# EAGLE design KimCard-r5 (EAGLE 7.2.0)
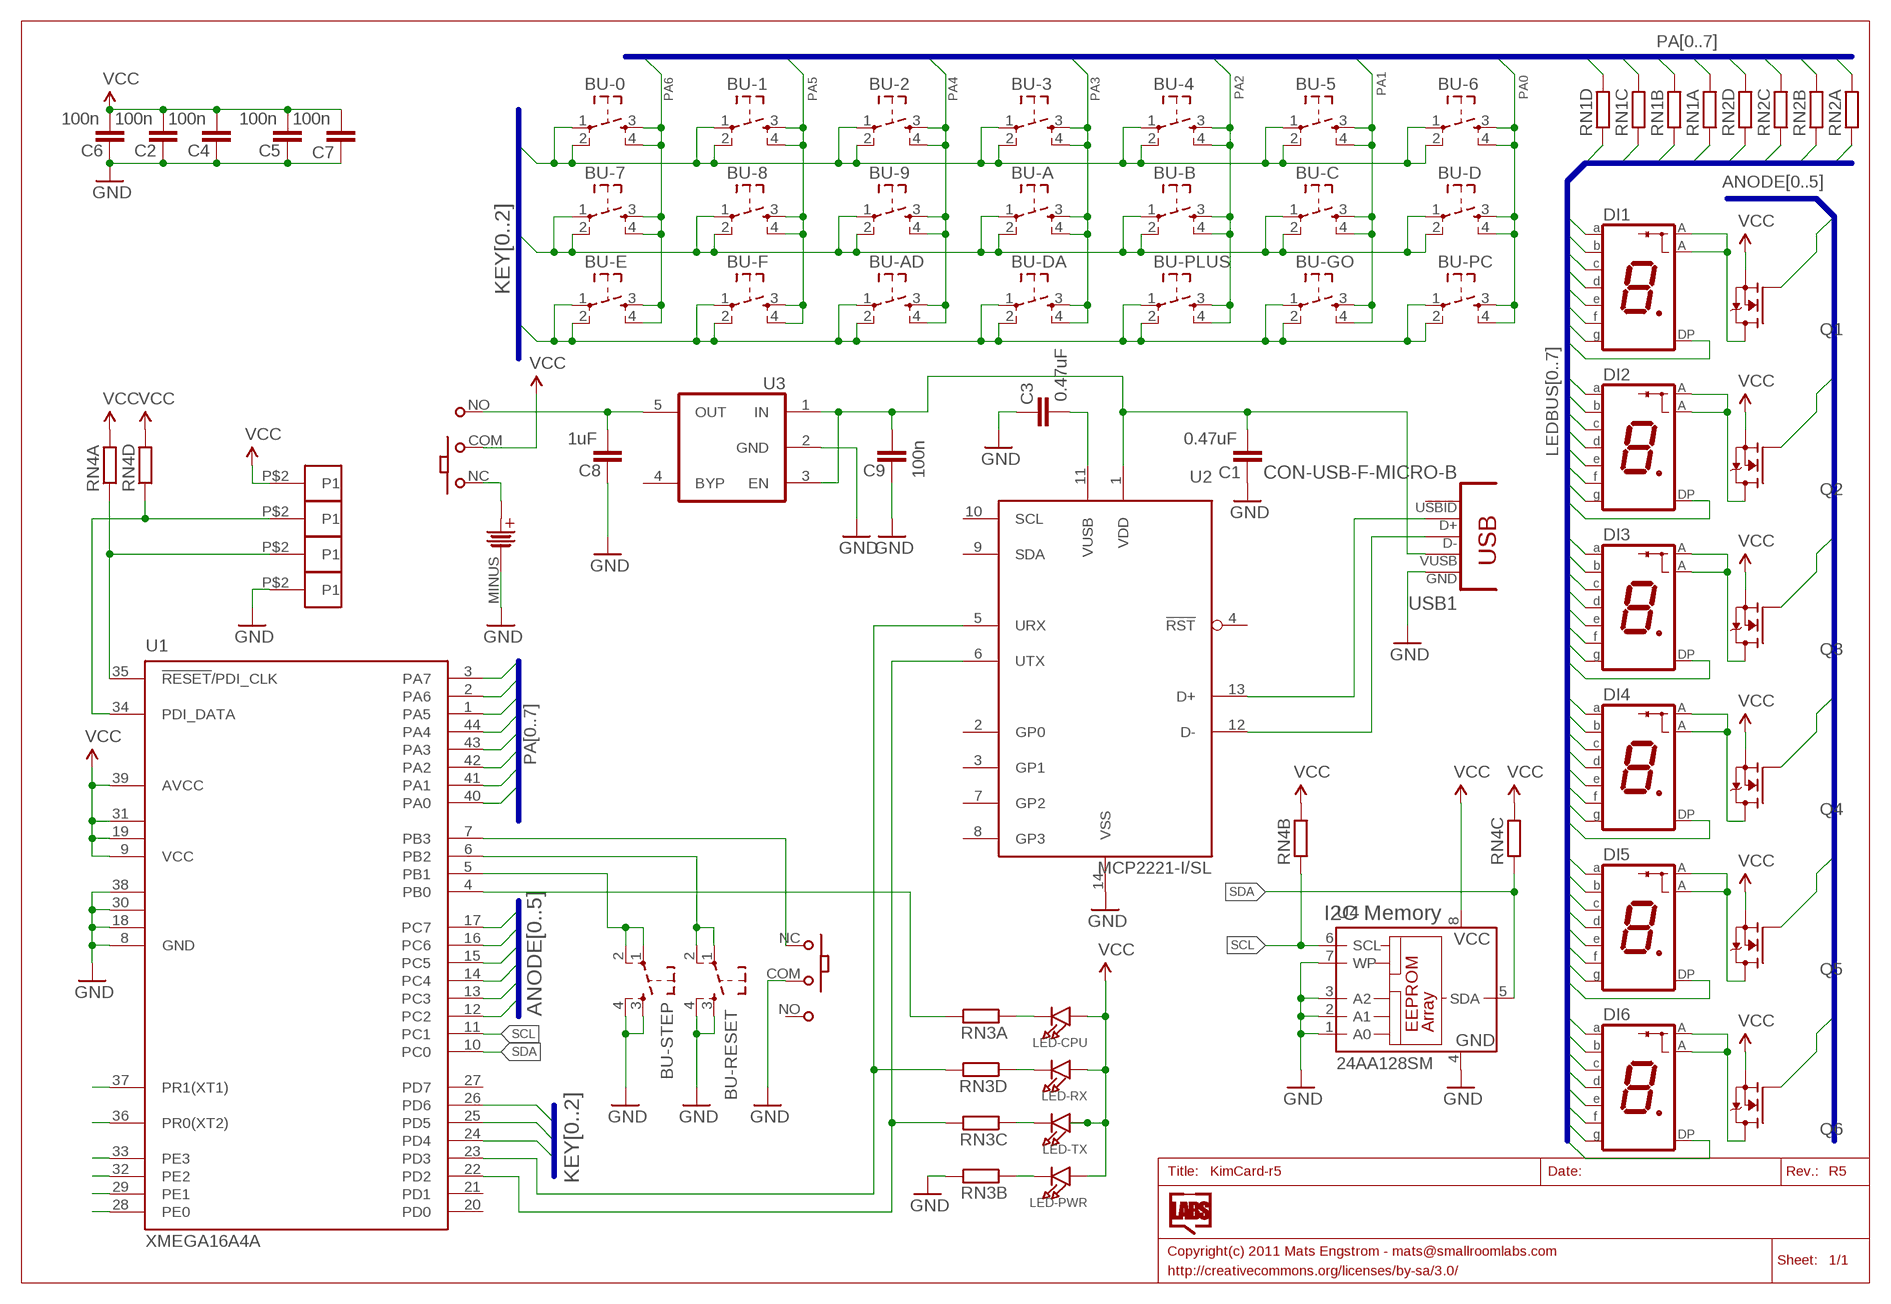
[diagram p0: schematic, sheet 1]

## Parts
BA1  BATTERY-3V  [AAAX2]
BU-0  SW_TACT_4P  [SW_TACT_SMALL]
BU-1  SW_TACT_4P  [SW_TACT_SMALL]
BU-2  SW_TACT_4P  [SW_TACT_SMALL]
BU-3  SW_TACT_4P  [SW_TACT_SMALL]
BU-4  SW_TACT_4P  [SW_TACT_SMALL]
BU-5  SW_TACT_4P  [SW_TACT_SMALL]
BU-6  SW_TACT_4P  [SW_TACT_SMALL]
BU-7  SW_TACT_4P  [SW_TACT_SMALL]
BU-8  SW_TACT_4P  [SW_TACT_SMALL]
BU-9  SW_TACT_4P  [SW_TACT_SMALL]
BU-A  SW_TACT_4P  [SW_TACT_SMALL]
BU-AD  SW_TACT_4P  [SW_TACT_SMALL]
BU-B  SW_TACT_4P  [SW_TACT_SMALL]
BU-C  SW_TACT_4P  [SW_TACT_SMALL]
BU-D  SW_TACT_4P  [SW_TACT_SMALL]
BU-DA  SW_TACT_4P  [SW_TACT_SMALL]
BU-E  SW_TACT_4P  [SW_TACT_SMALL]
BU-F  SW_TACT_4P  [SW_TACT_SMALL]
BU-GO  SW_TACT_4P  [SW_TACT_SMALL]
BU-PC  SW_TACT_4P  [SW_TACT_SMALL]
BU-PLUS  SW_TACT_4P  [SW_TACT_SMALL]
BU-RESET  SW_TACT_4P  [SW_TACT_SMALL]
BU-STEP  SW_TACT_4P  [SW_TACT_SMALL]
C1  0.47uF  CAP0805  [0805]
C2  100n  CAP0805  [0805]
C3  0.47uF  CAP0805  [0805]
C4  100n  CAP0805  [0805]
C5  100n  CAP0805  [0805]
C6  100n  CAP0805  [0805]
C7  100n  CAP0805  [0805]
C8  1uF  CAP0805  [0805]
C9  100n  CAP0805  [0805]
DI1  7SEG-CA2  [KCSA03]
DI2  7SEG-CA2  [KCSA03]
DI3  7SEG-CA2  [KCSA03]
DI4  7SEG-CA2  [KCSA03]
DI5  7SEG-CA2  [KCSA03]
DI6  7SEG-CA2  [KCSA03]
LED-CPU  LEDSMD0805  [CHIPLED_0805]
LED-PWR  LEDSMD0805  [CHIPLED_0805]
LED-RX  LEDSMD0805  [CHIPLED_0805]
LED-TX  LEDSMD0805  [CHIPLED_0805]
PDI-CLK  PAD-2X3  [PAD2X3]
PDI-DATA  PAD-2X3  [PAD2X3]
PDI-GND  PAD-2X3  [PAD2X3]
PDI-VCC  PAD-2X3  [PAD2X3]
Q1  TRANSISTOR_FET_BS170-SOT-23  [SOT-23]
Q2  TRANSISTOR_FET_BS170-SOT-23  [SOT-23]
Q3  TRANSISTOR_FET_BS170-SOT-23  [SOT-23]
Q4  TRANSISTOR_FET_BS170-SOT-23  [SOT-23]
Q5  TRANSISTOR_FET_BS170-SOT-23  [SOT-23]
Q6  TRANSISTOR_FET_BS170-SOT-23  [SOT-23]
RN1  RESISTOR_ARRAY_4  [RN8P-4R-CRA06S]
RN2  RESISTOR_ARRAY_4  [RN8P-4R-CRA06S]
RN3  RESISTOR_ARRAY_4  [RN8P-4R-CRA06S]
RN4  RESISTOR_ARRAY_4  [RN8P-4R-CRA06S]
U1  XMEGA16A4A  [TQFP44]
U2  MCP2221-I/SL  [SOIC14]
U3  VREG_5PINS-SOT-23-5  [SOT-23-5]
U4  24AA128SM  [SO-08M]
U$1  SLIDESWITCHPCM12SMTR  [PCM12SMTR]
U$2  SLIDESWITCHPCM12SMTR  [PCM12SMTR]
USB1  CON-USB-F-MICRO-B  [CONN_USB_MICRO-B]

## Nets
BAT: BA1.PLUS U$1.NC
CPU: RN3.8 U1.4(PB0)
GND [pwr2]: BA1.MINUS BU-RESET.3 BU-RESET.4 BU-STEP.3 BU-STEP.4 C1.1 C2.1 C3.1 C4.1 C5.1 C6.1 C7.1 C8.1 C9.1 PDI-GND.P$2(P1) RN3.7 U1.8(GND) U1.18(GND1) U1.30(GND2) U1.38(GND3) U2.14(VSS) U3.2(GND) U4.1(A0) U4.2(A1) U4.3(A2) U4.4(GND) U4.7(WP) U$2.COM USB1.P5(GND)
KEYROW0: BU-0.1 BU-0.2 BU-1.1 BU-1.2 BU-2.1 BU-2.2 BU-3.1 BU-3.2 BU-4.1 BU-4.2 BU-5.1 BU-5.2 BU-6.1 BU-6.2 U1.24(PD4)
KEYROW1: BU-7.1 BU-7.2 BU-8.1 BU-8.2 BU-9.1 BU-9.2 BU-A.1 BU-A.2 BU-B.1 BU-B.2 BU-C.1 BU-C.2 BU-D.1 BU-D.2 U1.25(PD5)
KEYROW2: BU-AD.1 BU-AD.2 BU-DA.1 BU-DA.2 BU-E.1 BU-E.2 BU-F.1 BU-F.2 BU-GO.1 BU-GO.2 BU-PC.1 BU-PC.2 BU-PLUS.1 BU-PLUS.2 U1.26(PD6)
LEDBUS0: DI1.P$7(A) DI2.P$7(A) DI3.P$7(A) DI4.P$7(A) DI5.P$7(A) DI6.P$7(A) RN2.1
LEDBUS1: DI1.P$6(B) DI2.P$6(B) DI3.P$6(B) DI4.P$6(B) DI5.P$6(B) DI6.P$6(B) RN2.2
LEDBUS2: DI1.P$4(C) DI2.P$4(C) DI3.P$4(C) DI4.P$4(C) DI5.P$4(C) DI6.P$4(C) RN2.3
LEDBUS3: DI1.P$2(D) DI2.P$2(D) DI3.P$2(D) DI4.P$2(D) DI5.P$2(D) DI6.P$2(D) RN2.4
LEDBUS4: DI1.P$1(E) DI2.P$1(E) DI3.P$1(E) DI4.P$1(E) DI5.P$1(E) DI6.P$1(E) RN1.1
LEDBUS5: DI1.P$9(F) DI2.P$9(F) DI3.P$9(F) DI4.P$9(F) DI5.P$9(F) DI6.P$9(F) RN1.2
LEDBUS6: DI1.P$10(G) DI2.P$10(G) DI3.P$10(G) DI4.P$10(G) DI5.P$10(G) DI6.P$10(G) RN1.3
LEDBUS7: DI1.P$5(DP) DI2.P$5(DP) DI3.P$5(DP) DI4.P$5(DP) DI5.P$5(DP) DI6.P$5(DP) RN1.4
LEDCA0: Q1.1(G) U1.12(PC2)
LEDCA1: Q2.1(G) U1.13(PC3)
LEDCA2: Q3.1(G) U1.14(PC4)
LEDCA3: Q4.1(G) U1.15(PC5)
LEDCA4: Q5.1(G) U1.16(PC6)
LEDCA5: Q6.1(G) U1.17(PC7)
N$1: RN3.5 U1.23(PD3) U2.5(URX)
N$2: LED-RX.C RN3.4
N$3: U2.13(D+) USB1.P3(D+)
N$4: U2.12(D-) USB1.P2(D-)
N$5: C3.2 U2.11(VUSB)
N$6: RN3.6 U1.22(PD2) U2.6(UTX)
N$7: LED-TX.C RN3.3
N$9: C8.2 U3.5(OUT) U$1.NO
N$11: LED-PWR.C RN3.2
N$12: LED-CPU.C RN3.1
PA0: BU-6.3 BU-6.4 BU-D.3 BU-D.4 BU-PC.3 BU-PC.4 RN2.8 U1.40(PA0)
PA1: BU-5.3 BU-5.4 BU-C.3 BU-C.4 BU-GO.3 BU-GO.4 RN2.7 U1.41(PA1)
PA2: BU-4.3 BU-4.4 BU-B.3 BU-B.4 BU-PLUS.3 BU-PLUS.4 RN2.6 U1.42(PA2)
PA3: BU-3.3 BU-3.4 BU-A.3 BU-A.4 BU-DA.3 BU-DA.4 RN2.5 U1.43(PA3)
PA4: BU-2.3 BU-2.4 BU-9.3 BU-9.4 BU-AD.3 BU-AD.4 RN1.8 U1.44(PA4)
PA5: BU-1.3 BU-1.4 BU-8.3 BU-8.4 BU-F.3 BU-F.4 RN1.7 U1.1(PA5)
PA6: BU-0.3 BU-0.4 BU-7.3 BU-7.4 BU-E.3 BU-E.4 RN1.6 U1.2(PA6)
PA7: RN1.5 U1.3(PA7)
PDI_CLOCK: PDI-CLK.P$2(P1) RN4.1 U1.35(!RESET!/PDI_CLK)
PDI_DATA: PDI-DATA.P$2(P1) RN4.4 U1.34(PDI_DATA)
PE0: U1.28(PE0)
PE1: U1.29(PE1)
PE2: U1.32(PE2)
PE3: U1.33(PE3)
PR1: U1.37(PR1(XT1))
PR2: U1.36(PR0(XT2))
Q1C: DI1.P$3(A) DI1.P$8(A) Q1.3(D)
Q2C: DI2.P$3(A) DI2.P$8(A) Q2.3(D)
Q3C: DI3.P$3(A) DI3.P$8(A) Q3.3(D)
Q4C: DI4.P$3(A) DI4.P$8(A) Q4.3(D)
Q5C: DI5.P$3(A) DI5.P$8(A) Q5.3(D)
Q6C: DI6.P$3(A) DI6.P$8(A) Q6.3(D)
RSET: BU-RESET.1 BU-RESET.2 U1.6(PB2)
SCL: RN4.2 U1.11(PC1) U4.6(SCL)
SDA: RN4.3 U1.10(PC0) U4.5(SDA)
SST: U1.7(PB3) U$2.NC
STEP: BU-STEP.1 BU-STEP.2 U1.5(PB1)
VCC [pwr1]: C2.2 C4.2 C5.2 C6.2 C7.2 LED-CPU.A LED-PWR.A LED-RX.A LED-TX.A PDI-VCC.P$2(P1) Q1.2(S) Q2.2(S) Q3.2(S) Q4.2(S) Q5.2(S) Q6.2(S) RN4.5 RN4.6 RN4.7 RN4.8 U1.9(VCC) U1.19(VCC1) U1.31(VCC2) U1.39(AVCC) U4.8(VCC) U$1.COM
VUSB: C1.2 C9.2 U2.1(VDD) U3.1(IN) U3.3(EN) USB1.P1(VUSB)
Unconnected: U1.20(PD0) U1.21(PD1) U1.27(PD7) U2.2(GP0) U2.3(GP1) U2.4(!RST) U2.7(GP2) U2.8(GP3) U2.9(SDA) U2.10(SCL) U3.4(BYP) U$2.NO USB1.BODY@1(BODY) USB1.BODY@2(BODY) USB1.BODY@3(BODY) USB1.BODY@4(BODY) USB1.P4(USBID)

## Buses
LEDBUS[0..7]
PA[0..7]
ANODE[0..5]
KEY[0..2]

## Notes on the sheet
- I2C Memory

## Library data of the parts
BA1 = SmallRoomLabs_Battery:BATTERY-3V
BU-0 BU-1-BU-9 BU-A BU-AD BU-B BU-C BU-D BU-DA BU-E BU-F BU-GO BU-PC BU-PLUS BU-RESET BU-STEP = dp_devices:SW_TACT_4P
C1-C9 = SparkFun:CAP: Capacitor Standard 0603 ceramic capacitor, and 0.1" leaded capacitor.
DI1-DI6 = SmallRoomLabs_Led:7SEG-CA2
LED-CPU LED-PWR LED-RX LED-TX = SmallRoomLabs:LED
PDI-CLK PDI-DATA PDI-GND PDI-VCC = SmallRoomLabs:PAD
Q1-Q6 = dp_devices:TRANSISTOR_FET_BS170: N-Channel Enhancement Mode Field Effect Transistor
RN1-RN4 = dp_devices:RESISTOR_ARRAY_4: 4 Resistor Array 0603
U1 = atmel:XMEGA16A4: MICROCONTROLLER Features High-performance, Low-power 8/16-bit AVR XMEGA Microcontroller Non-Volatile Program and Data Memories - 16 KB - 128 KB of In-System Self-Programmable Flash - 4 KB - 8 KB Boot Code Section with Independent Lock Bits - 1 KB - 2 KB EEPROM - 2 KB - 8 KB Internal SRAM Peripheral Features - Four-channel DMA Controller with support for external requests - Eight-channel Event System - Five 16-bit Timer/Counters Three Timer/Counters with 4 Output Compare or Input Capture channels Two Timer/Counters with 2 Output Compare or Input Capture channels High-Resolution Extensions on all Timer/Counters Advanced Waveform Extension on one Timer/Counter - Five USARTs IrDA Extension on one USART - Two Two-Wire Interfaces with dual address match (I2C and SMBus compatible) - Two SPIs (Serial Peripheral Interfaces) peripherals - AES and DES Crypto Engine - 16-bit Real Time Counter with Separate Oscillator - One Twelve-channel, 12-bit, 2 Msps Analog to Digital Converter - One Two-channel, 12-bit, 1 Msps Digital to Analog Converter - Two Analog Comparators with Window compare function - External Interrupts on all General Purpose I/O pins - Programmable Watchdog Timer with Separate On-chip Ultra Low Power Oscillator Special Microcontroller Features - Power-on Reset and Programmable Brown-out Detection - Internal and External Clock Options with PLL - Programmable Multi-level Interrupt Controller - Sleep Modes: Idle, Power-down, Standby, Power-save, Extended Standby - Advanced Programming, Test and Debugging Interfaces PDI (Program and Debug Interface) for programming, test and debugging I/O and Packages - 34 Programmable I/O Lines - 44 - lead TQFP - 44 - pad VQFN/QFN - 49 - ball VFBGA Operating Voltage - 1.6 - 3.6V Speed performance - 0 - 12 MHz @ 1.6 - 3.6V - 0 - 32 MHz @ 2.7 - 3.6V Drawn by Dipl.-Ing. (FH) Robert Siegler Created: 27.05.09; OC_FARNELL: unknown; OC_NEWARK: unknown
U2 = microchip-mcp2221:MCP2221-*: MCP2221 in PDIP, SOIC and TSSOP package The MCP2221 is a USB-to-UART/I2C serial converter which enables USB connectivity in applications that have a UART and I2C interfaces. The device reduces external components by integrating the USB termination resistors and the oscillator needed for USB operation. The MCP2221 also has four GP pins providing miscellaneous functionalities (GPIO, USBCFG, SSPND, Clock Output, ADC, DAC, interrupt detector). Source: www.microchip.com/MCP2221 <http://www.microchip.com/wwwproducts/Devices.aspx?product=MCP2221> and www.microchipdirect.com <http://www.microchipdirect.com/ProductDetails.aspx?Category=MCP2221> Tutorial: MCP2221 by Arnauld Biganzoli <https://docs.google.com/document/d/1P3zzqCKdEXzCe--1Yyg8PClCZKsUri8pyNO7AV2daaw/edit?usp=sharing>
U3 = dp_devices:VREG_5PINS: 5 pins voltage regulator
U4 = microchip:24*: Serial EEPROM I2C; MF: MICROCHIP; MPN: 24AA128-I/MS; OC_FARNELL: 1331285; OC_NEWARK: 92C6839
U$1 U$2 = Nerdlabs:SLIDESWITCH
USB1 = dp_devices:CON-USB-F: USB Female connector

## Net classes
0 default: width 0.203 mm, drill 0.305 mm, clearance 0.203 mm
1 pwr1: width 0.203 mm, drill 0.305 mm, clearance 0.203 mm
2 gnd1: width 0.203 mm, drill 0.305 mm, clearance 0.203 mm
3 pwr2: width 0.203 mm, drill 0.305 mm, clearance 0.203 mm

## Board
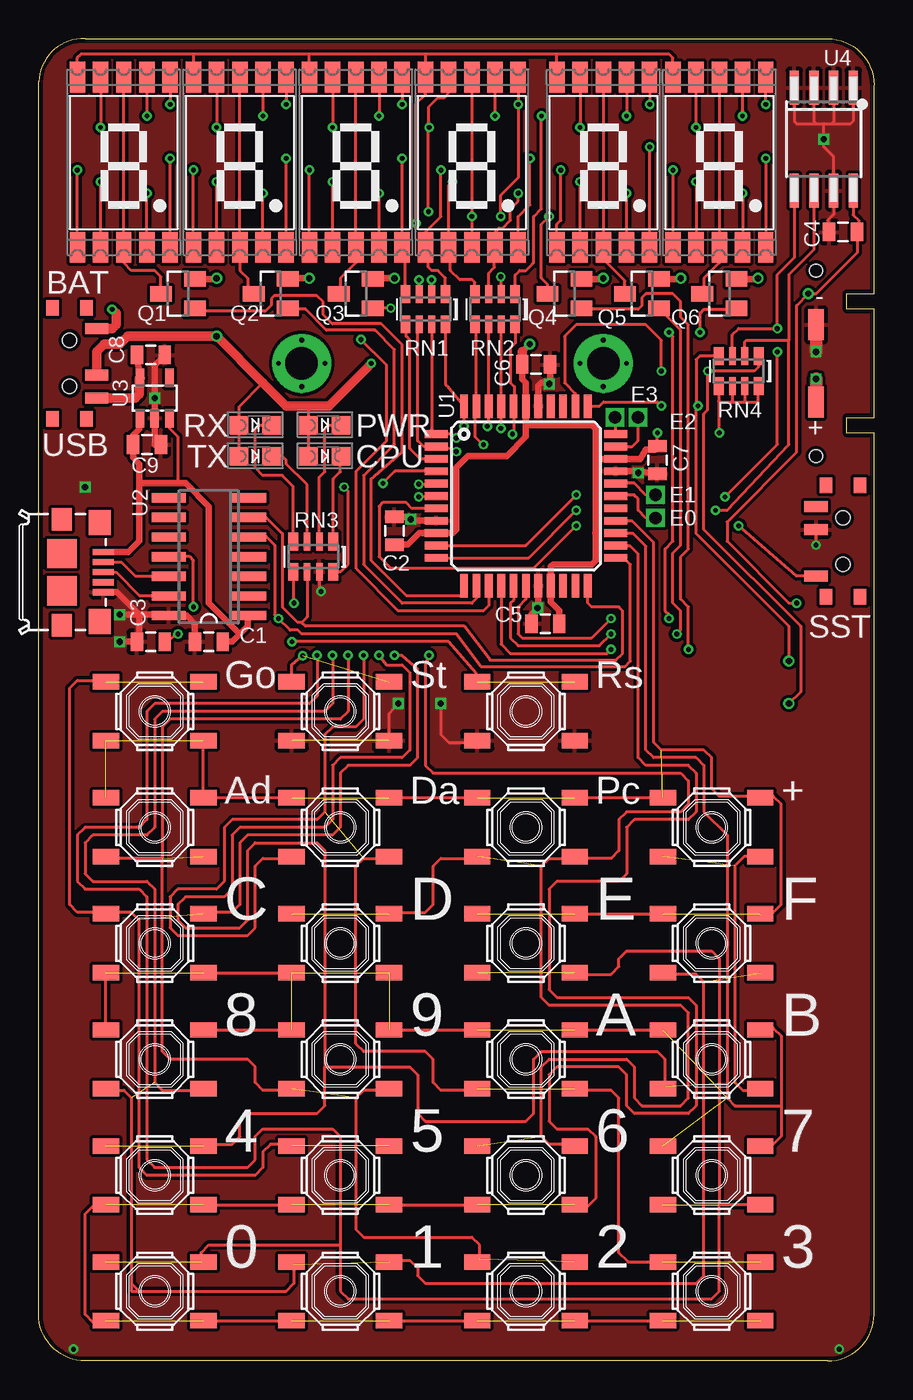
[diagram p1: board, top side]
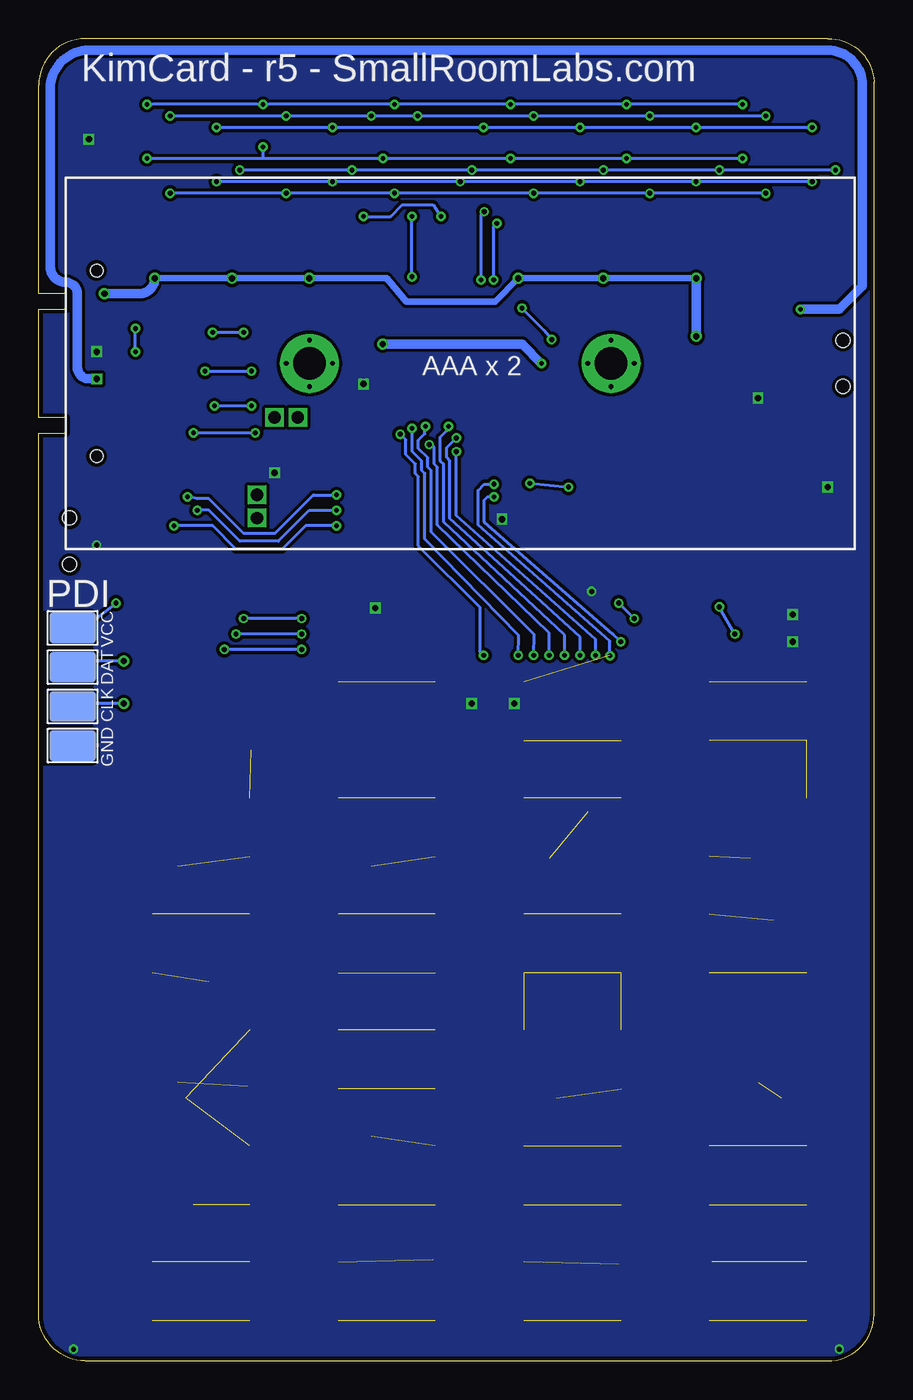
[diagram p2: board, bottom side, seen from below]

Size 54 x 85.5 mm. Coordinates in mm from the lower left corner, seen from the top.
Outline: 54,3 arc-90 51,0 3,0 arc-90 0,3 0,82.7 arc-90 3,85.5 51,85.5 arc-90 54,82.5
Outline: 54,82.5 arc0 54,82.5
Outline: 54,3 54,60 52.25,60 52.25,61 54,61 54,68 52.25,68 52.25,69 54,69 54,82.5
Copper layers (1*16): Top 0.035mm / dielectric 1.5mm / Bottom 0.035mm
Design rules "dirt_cheap_dirty_boards.v1": minimum track width 5mil, minimum drill 12mil, track to track 5mil, track to pad 5mil, pad to pad 5mil, via to via 5mil, smd to smd 0mil, copper to edge 10mil, drill to drill 10mil, minimum pad ring 10mil, minimum via ring 6mil, stop-mask expansion 2mil, vias tented up to drill 25mil, thermal gap 10mil
tKeepout: area 22.1,17.8 to 24.1,20.1
tRestrict: area 23.5,66.3 to 31.2,69.5
bRestrict: area 50.5,38.5 to 54,48.5

### Footprints (pad centres in the part's own frame; a part is rotated, then mirrored left to right if it is on the bottom)
AAAX2 = drill 2.1 pad 3.8: 1 -9.75,0; 2 9.75,0 | drill 0.305: 3 -11.25,0; 4 -8.25,0; 5 -9.75,-1.5; 6 -9.75,1.5; 7 8.25,0; 8 11.25,0; 9 9.75,-1.5; 10 9.75,1.5 | smd 1 x 2 bottom: MINUS 23.5,-2.5; PLUS 23.5,2.5 | hole 0.813: 23.5,6; 23.5,-6
SW_TACT_SMALL = smd 1.7 x 1: 1 -3.15,1.9; 2 3.15,1.9; 3 -3.15,-1.9; 4 3.15,-1.9
0805 = smd 0.8 x 1.2: 1 -0.9,0; 2 0.9,0
KCSA03 = smd 1 x 2: P$1 -3,-5.5; P$2 -1.5,-5.5; P$3 0,-5.5; P$4 1.5,-5.5; P$5 3,-5.5; P$6 3,5.5; P$7 1.5,5.5; P$8 0,5.5; P$9 -1.5,5.5; P$10 -3,5.5
CHIPLED_0805 = smd 1.2 x 1.2: A 0,-1.05; C 0,1.05
PAD2X3 = smd 2 x 3: P$2 0,0
SOT-23 = smd 1 x 1.4: 1 -0.95,-1.1; 2 0.95,-1.1; 3 0,1.1
RN8P-4R-CRA06S = smd 0.63 x 1.15: 1 -1.295,-0.975; 4 1.295,-0.975; 5 1.295,0.975; 8 -1.295,0.975 | smd 0.44 x 1.15: 2 -0.4,-0.975; 3 0.4,-0.975; 6 0.4,0.975; 7 -0.4,0.975
TQFP44 = smd 1.5 x 0.5: 1 -5.8,4; 2 -5.8,3.2; 3 -5.8,2.4; 4 -5.8,1.6; 5 -5.8,0.8; 6 -5.8,0; 7 -5.8,-0.8; 8 -5.8,-1.6; 9 -5.8,-2.4; 10 -5.8,-3.2; 11 -5.8,-4; 23 5.8,-4; 24 5.8,-3.2; 25 5.8,-2.4; 26 5.8,-1.6; 27 5.8,-0.8; 28 5.8,0; 29 5.8,0.8; 30 5.8,1.6; 31 5.8,2.4; 32 5.8,3.2; 33 5.8,4 | smd 0.5 x 1.5: 12 -4,-5.8; 13 -3.2,-5.8; 14 -2.4,-5.8; 15 -1.6,-5.8; 16 -0.8,-5.8; 17 0,-5.8; 18 0.8,-5.8; 19 1.6,-5.8; 20 2.4,-5.8; 21 3.2,-5.8; 22 4,-5.8; 34 4,5.8; 35 3.2,5.8; 36 2.4,5.8; 37 1.6,5.8; 38 0.8,5.8; 39 0,5.8; 40 -0.8,5.8; 41 -1.6,5.8; 42 -2.4,5.8; 43 -3.2,5.8; 44 -4,5.8
SOIC14 = smd 0.6 x 2.2: 1 -3.81,-2.6; 2 -2.54,-2.6; 3 -1.27,-2.6; 4 0,-2.6; 5 1.27,-2.6; 6 2.54,-2.6; 7 3.81,-2.6; 8 3.81,2.6; 9 2.54,2.6; 10 1.27,2.6; 11 0,2.6; 12 -1.27,2.6; 13 -2.54,2.6; 14 -3.81,2.6
SOT-23-5 = smd 0.55 x 1.2: 1 -0.95,-1.3; 2 0,-1.3; 3 0.95,-1.3; 4 0.95,1.3; 5 -0.95,1.3
SO-08M = smd 0.6 x 2.2: 1 -1.905,-3.33; 2 -0.635,-3.33; 3 0.635,-3.33; 4 1.905,-3.33; 5 1.905,3.33; 6 0.635,3.33; 7 -0.635,3.33; 8 -1.905,3.33
PCM12SMTR = smd 0.7 x 1.5: COM 0.75,1.75; NC -2.25,1.75; NO 2.25,1.75 | smd 1 x 0.8: P$1 -3.6,-1.1; P$2 -3.6,1.1; P$3 3.6,1.1; P$4 3.6,-1.1 | hole 0.9: -1.5,0; 1.5,0
CONN_USB_MICRO-B = smd 1.6 x 1.4: BODY@1 -3.2,2.45; BODY@2 3.2,2.45 | smd 1.45 x 1.3: BODY@3 3.425,0; BODY@6 -3.425,0 | smd 1.9 x 1.9: BODY@4 1.2,0; BODY@5 -1.2,0 | smd 0.4 x 1.35: P1 -1.3,2.675; P2 -0.65,2.675; P3 0,2.675; P4 0.65,2.675; P5 1.3,2.675

### Placement (x,y rotation side)
BA1  26.75,64.5 180 bottom
BU-0  7.5,4.5 180 top
BU-1  19.5,4.5 180 top
BU-2  31.5,4.5 180 top
BU-3  43.5,4.5 180 top
BU-4  7.5,12 180 top
BU-5  19.5,12 180 top
BU-6  31.5,12 180 top
BU-7  43.5,12 0 top
BU-8  7.5,19.5 0 top
BU-9  19.5,19.5 0 top
BU-A  31.5,19.5 0 top
BU-AD  7.5,34.5 0 top
BU-B  43.5,19.5 0 top
BU-C  7.5,27 180 top
BU-D  19.5,27 180 top
BU-DA  19.5,34.5 0 top
BU-E  31.5,27 0 top
BU-F  43.5,27 0 top
BU-GO  7.5,42 180 top
BU-PC  31.5,34.5 0 top
BU-PLUS  43.5,34.5 0 top
BU-RESET  31.5,42 0 top
BU-STEP  19.5,42 0 top
C1  11,46.5 0 top
C2  23,53.67 270 top
C3  7.25,46.5 0 top
C4  52,73 0 top
C5  32.75,47.67 0 top
C6  32.16,64.42 180 top
C7  40,58.25 90 top
C8  7.25,65.05 180 top
C9  7,59.25 180 top
DI1  5.5,77.5 0 top
DI2  13,77.5 0 top
DI3  20.5,77.5 0 top
DI4  28,77.5 0 top
DI5  36.5,77.5 0 top
DI6  44,77.5 0 top
LED-CPU  18.5,58.5 270 top
LED-PWR  18.5,60.5 270 top
LED-RX  14,60.5 270 top
LED-TX  14,58.5 270 top
PDI-CLK  51.8,42.32 90 bottom
PDI-DATA  51.8,44.86 90 bottom
PDI-GND  51.8,39.78 90 bottom
PDI-VCC  51.8,47.4 90 bottom
Q1  9,69 90 top
Q2  15,69 90 top
Q3  20.5,69 90 top
Q4  34,69 90 top
Q5  39,69 90 top
Q6  44,69 90 top
RN1  25,68 180 top
RN2  29.5,68 180 top
RN3  17.75,52 180 top
RN4  45.25,64 180 top
U1  31.5,55.92 0 top
U2  11,52 90 top
U3  7.5,62.25 0 top
U4  50.75,79 180 top
U$1  2,64.5 270 top
U$2  52,53 90 top
U$7  [SRL-LOGO-STOP-5MM]  41,39 0 top
USB1  1.5,51 270 top

### Tracks (layer width: path | path; a pad name or v marks a point on that pad's centre or on a via)
BAT  (via drill 0.3, 0.4)
  Top 0.61: U$1.NC 4.75,66.75 5,67 5,67.75 v4.75,68
  Top 0.813: BA1.PLUS v50.25,63.5
  Bottom 0.61: v4.75,68 2.25,68 0.75,69.5 0.75,82.5 arc-90 3,84.75 50.75,84.75 arc-90 53.25,82.25 53.25,70.75 arc-90 52.25,69.75 arc90 51.5,69 51.5,64.25 arc-90 50.75,63.5 v50.25,63.5
CPU  (via drill 0.3)
  Top 0.203: RN3.8 19.52,51.03 20,51.5 20,56.25 v19.75,56.5 | U1.4 23.02,57.52 v22.25,56.75
  Bottom 0.203: v22.25,56.75 v19.75,56.5
GND  (via drill 0.3, 0.4)  (1 unrouted)
  Top 0.203: BU-STEP.4 22.65,41.85 v23.25,42.5 | C4.1 51,73.1 51,73.75 51.38,74.14 U4.7 51.38,77.87 50.75,78.5 v50.75,79 50.75,80 | U4.4 48.84,80.16 49,80 50.25,80 | 50.25,80 50.75,80 | 50.75,80 51.25,80 | 51.25,80 52.5,80 52.66,80.16 U4.1 | U4.3 50.12,80.14 50.25,80 | U4.2 51.38,80.14 51.25,80 | v26,42.5 26,40.5 26.5,40 28.25,40 BU-RESET.3 | RN3.7 18.15,49.85 v18.25,49.75 | v50.25,52.75 U$2.COM
  Top 0.406: C9.1 7.5,59.25 U3.2 v7.5,62.25 7.5,64.4 C8.1 | U1.30 38.65,57.52 v38.75,57.42 38.9,57.52 C7.1 | U1.18 32.3,48.72 v32.25,48.67 31.85,48.27 C5.1 | C2.1 24.1,54.57 v24.05,54.42 24.15,54.32 U1.8 | USB1.P5 5.05,49.7 6.5,48.25 | C1.1 10.1,47.65 9.56,48.19 U2.14 8.34,48.25 6.5,48.25 | v5.25,48.25 6.5,48.25 | v5.25,46.5 C3.1 6.5,46.65 6.5,48.25 | U1.38 32.3,63.05 32.5,63.25 32.92,63.25 v33,63.17 33.06,63.23 C6.1
  Top 0.813: BA1.MINUS v50.25,65.25
  other vias: 3,56.5 51.75,0.75 2.25,0.75
  pour Top: 0,5.5 0,3 arc90 3,0 22.25,0 51,0 arc90 54,3 54,35 54,82.5 arc90 51,85.5 24.75,85.5 3,85.5 arc90 0,82.5 0,5.75
  pour Bottom: 0,16.5 0,3 arc90 3,0 28,0 51,0 arc90 54,3 54,36.75 54,82.5 arc90 51,85.5 25.5,85.5 3,85.5 arc90 0,82.5
KEYROW0  (7 unrouted)
  Top 0.203: BU-0.1 BU-1.2 | BU-1.1 BU-2.2 | BU-2.1 BU-3.2 | BU-4.1 BU-5.2 | BU-5.1 BU-6.2 | BU-6.1 34.65,10 35.5,10 36,10.5 36,14.5 35.5,15 33.5,15 33,15.5 33,18.5 33.5,19 37.5,19 38,18.5 38,16.5 38.5,16 42,16 42.5,16.5 42.5,23 42,23.5 33.5,23.5 33,24 33,30.5 33.5,31 37.5,31 38,31.5 38,34.5 38.5,35 42,35 42.5,35.5 42.5,38 42,38.5 39.25,38.5 38.75,39 38.75,52.17 38.25,52.67 37.35,52.67 U1.24 | BU-4.2 3.6,10.1 3,9.5 3,3 3.5,2.5 3.6,2.6 BU-0.2
KEYROW1  (7 unrouted)
  Top 0.203: BU-8.2 BU-9.1 | BU-9.2 BU-A.1 | BU-A.2 BU-B.1 | 48,16.5 48,21 47.5,21.5 46.75,21.5 BU-B.2 | 48,16.5 48,14.5 47.5,14 46.65,14 BU-7.2 | BU-8.1 BU-C.2 | BU-C.1 BU-D.2 | 48,16.5 45,16.5 44.5,17 44.5,34 43,35.5 43,38.5 42.5,39 39.75,39 39.25,39.5 39.25,52.67 38.4,53.52 U1.25
KEYROW2  (7 unrouted)
  Top 0.203: 46.65,36.5 47.5,36.5 48,36 48,29.5 47.4,28.9 BU-F.2 | 46.65,36.5 BU-PLUS.2 | BU-PLUS.1 BU-PC.2 | BU-PC.1 BU-DA.2 | BU-DA.1 BU-AD.2 BU-GO.1 | BU-E.2 BU-F.1 | 46.65,36.5 44,36.5 43.5,37 43.5,39 43,39.5 40.25,39.5 39.75,40 39.75,52.92 38.35,54.32 U1.26
LEDBUS0  (via drill 0.3)
  Top 0.203: RN2.1 30.8,70.22 31.09,70.51 31.5,70.51 31.9,70.92 31.92,70.92 32,71 32,74 32.5,74.5 v32.5,80.5 | 29.46,83.04 DI4.P$7 v29.5,80.5 | DI1.P$7 v7,80.5 | v45.5,80.5 DI6.P$7 | DI5.P$7 v38,80.5 | DI2.P$7 v14.5,80.5 | DI3.P$7 v22,80.5
  Bottom 0.203: v7,80.5 v14.5,80.5 v22,80.5 v29.5,80.5 v32.5,80.5 v38,80.5 v45.5,80.5
LEDBUS1  (via drill 0.3)
  Top 0.203: RN2.2 29.9,70.08 v29.87,70.11 | DI1.P$6 v8.5,81.25 | v47,81.25 DI6.P$6 | DI5.P$6 v39.5,81.25 | DI4.P$6 v31,81.25 31,76.5 29.87,75.37 v29.87,74.01 | DI3.P$6 v23.5,81.25 | DI2.P$6 v16,81.25
  Bottom 0.203: v29.87,70.11 v29.87,74.01 | v8.5,81.25 v16,81.25 v23.5,81.25 v31,81.25 v39.5,81.25 v47,81.25
LEDBUS2  (via drill 0.3)
  Top 0.203: RN2.3 29.1,70.35 29.46,70.72 DI4.P$4 | 29.46,71.97 DI4.P$4 | DI1.P$4 v7,75.5 | v45.5,75.5 DI6.P$4 | DI5.P$4 v38,75.5 | DI4.P$4 29.5,73 29.75,73.25 30,73.25 30.5,73.75 30.5,74.5 31,75 v31,75.5 | DI3.P$4 v22,75.5 | DI2.P$4 v14.5,75.5
  Bottom 0.203: v7,75.5 v14.5,75.5 v22,75.5 v31,75.5 v38,75.5 v45.5,75.5
LEDBUS3  (via drill 0.3)
  Top 0.203: RN2.4 28.2,69.74 28.04,69.9 27.23,69.9 26.62,70.51 26.62,71.88 DI4.P$2 26.5,76 v26.75,76.25 | DI1.P$2 v4,76.25 | v42.5,76.25 DI6.P$2 | DI5.P$2 v35,76.25 | DI3.P$2 v19,76.25 | DI2.P$2 v11.5,76.25
  Bottom 0.203: v4,76.25 v11.5,76.25 v19,76.25 v26.75,76.25 v35,76.25 v42.5,76.25
LEDBUS4  (via drill 0.3)
  Top 0.203: RN1.1 26.3,70.02 25.81,70.51 25.4,70.51 25.2,70.72 25.2,71.8 DI4.P$1 25,73 26,74 v26,77 | DI1.P$1 v2.5,77 | v41,77 DI6.P$1 | DI5.P$1 33.5,73.5 33.75,73.75 v33.75,77 | DI3.P$1 v17.5,77 | DI2.P$1 v10,77
  Bottom 0.203: v2.5,77 v10,77 v17.5,77 v26,77 v33.75,77 v41,77
LEDBUS5  (via drill 0.3)
  Top 0.203: RN1.2 v25.4,69.9 | v25.2,74.31 25.2,79.55 | DI4.P$9 26.62,82.88 26.62,82.09 26.21,81.69 25.81,81.69 25.2,81.08 25.2,79.55 | DI1.P$9 v4,79.75 | v42.5,79.75 DI6.P$9 | DI5.P$9 v35,79.75 | DI3.P$9 v19,79.75 | 25.2,79.55 v25.25,79.75 | DI2.P$9 v11.5,79.75
  Bottom 0.203: v25.4,69.9 25.4,74.11 v25.2,74.31 | v4,79.75 v11.5,79.75 v19,79.75 v25.25,79.75 v35,79.75 v42.5,79.75
LEDBUS6  (via drill 0.3)
  Top 0.203: RN1.3 24.6,69.89 v24.59,69.9 | v24.38,73.56 24.38,81.28 24.99,81.89 DI4.P$10 25,84.5 | DI1.P$10 2.5,84.25 2.75,84.5 10,84.5 | 10,84.5 DI2.P$10 | DI6.P$10 41,84.25 40.75,84.5 33.5,84.5 | 33.5,84.5 25,84.5 | 25,84.5 17.5,84.5 | 17.5,84.5 10,84.5 | DI3.P$10 17.5,84.5 | DI5.P$10 33.5,84.5
  Bottom 0.203: v24.59,69.9 24.59,73.36 v24.38,73.56
LEDBUS7  (via drill 0.3)
  Top 0.203: DI1.P$5 v8.5,77.75 | v47,77.75 DI6.P$5 | DI5.P$5 v39.5,78.5 | DI4.P$5 31,74 31.75,74.75 v31.75,77.75 | v23.5,77.75 DI3.P$5 23.7,71.8 RN1.4 | DI2.P$5 v16,77.75
  Bottom 0.203: v8.5,77.75 v16,77.75 v23.5,77.75 v31.75,77.75 39.5,77.75 | 39.5,77.75 v47,77.75 | v39.5,78.5 39.5,77.75
LEDCA0
  Top 0.203: 27.36,49.99 U1.12 27.5,49.5 23.75,49.5 21.48,51.78 21.48,56.99 23.5,58.75 23.5,65.71 22.15,67.06 18.99,67.06 18.38,67.67 18.38,68.48 17.98,68.89 15.24,68.89 15.04,68.68 15.04,68.28 14.63,67.87 10.28,67.87 Q1.1
LEDCA1
  Top 0.203: 16.26,67.9 Q2.1 16.15,68 17.25,68 18.6,66.65 21.74,66.65 23,65.39 23,59.25 21,57.25 21,51.5 23.5,49 28,49 28.3,49.3 U1.13
LEDCA2  (via drill 0.3)
  Top 0.203: U1.14 29.1,48.85 28.75,48.5 23.25,48.5 20.5,51.25 20.5,57.5 22.5,59.5 22.5,64.38 v20.84,66.04 | v22.76,68.07 21.62,68.07 Q3.1
  Bottom 0.203: v20.84,66.04 21.34,66.65 v22.76,68.07
LEDCA3  (via drill 0.3)
  Top 0.203: U1.15 29.9,46.35 30.5,45.75 36.75,45.75 v37,46 | Q4.1 35.15,68 38.75,68 39,68.25 39,68.75 39.25,69 41,69 41.5,68.5 41.5,67.5 42,67 42,52.5 41.5,52 41.5,49.25 42,48.75 v42,46
  Bottom 0.203: v37,46 v42,46
LEDCA4  (via drill 0.3)
  Top 0.203: U1.16 30.7,49.2 30.5,49 30.5,46.75 31,46.25 36.25,46.25 v37,47 | v41.25,47 41.5,47.25 41.5,48.5 41,49 41,52.25 41.5,52.75 41.5,66.65 Q5.1
  Bottom 0.203: v37,47 v41.25,47
LEDCA5  (via drill 0.3)
  Top 0.203: U1.17 31.5,49.25 31,48.75 31,47 31.25,46.75 35.75,46.75 v37,48 | v40.75,48 40.75,48.25 40.5,48.5 40.5,52.5 41,53 41,66.25 v40.75,66.5 | v42.75,66.5 42.75,67.75 43,68 45.05,68 Q6.1
  Bottom 0.203: v37,48 v40.75,48 | v40.75,66.5 v42.75,66.5
N$1  (via drill 0.3)
  Top 0.203: 37.17,51.79 U1.23 37.38,52 37.75,52 38.25,51.5 38.25,45.25 37.91,44.91 28.59,44.91 27,47 17,47 16.75,47.25 16.25,47.25 v15.5,48 15.25,48.25 15.25,52.75 14.73,53.27 U2.5 13.58,53.25 | RN3.5 16.45,49.05 v16.5,49
  Bottom 0.203: v16.5,49 v15.5,48
N$2
  Top 0.203: RN3.4 16.45,56.55 15.75,57.25 14.5,57.25 14,57.75 14,60.25 14.25,60.5 LED-RX.C
N$3
  Top 0.203: USB1.P3 5,51 6.5,49.5 8.36,49.5 U2.13
N$4
  Top 0.203: USB1.P2 5.35,51.65 6.27,50.73 U2.12
N$5  (via drill 0.3)
  Top 0.203: C3.2 8.4,46.6 v9,47 | v10,48.75 10,51.75 9.75,52 U2.11
  Bottom 0.203: v9,47 v10,48.75
N$6
  Top 0.203: 35.54,50.08 U1.22 35.5,49 35.75,48.75 37.5,48.75 37.75,48.5 37.75,45.75 37.31,45.32 29.19,45.32 27.5,47.5 17.25,47.5 17,47.75 | U2.6 14.71,54.54 15.75,53.5 15.75,48.75 16.75,47.75 17,47.75 | RN3.6 17.35,48.1 17,47.75
N$7
  Top 0.203: RN3.3 17.35,56.65 16,58 16,58.25 15.75,58.5 LED-TX.C
N$9
  Top 0.406: U3.5 C8.2
  Top 0.61: U$1.NO 6.25,62.25 6.5,62.5 6.5,63.5 U3.5
N$11
  Top 0.203: RN3.2 18.15,57.15 18.5,57.5 18.5,60.25 18.75,60.5 LED-PWR.C
N$12
  Top 0.203: RN3.1 19.05,57.05 19.5,57.5 19.5,58.45 LED-CPU.C
PA0  (via drill 0.3)  (3 unrouted)
  Top 0.203: 34.65,32.5 33,32.5 32.5,32 32.5,23.5 33,23 41.5,23 42,22.5 42,17 41.5,16.5 39,16.5 38.5,17 38.5,19 38,19.5 33,19.5 32.5,19 32.5,14.5 33,14 34.55,14 BU-6.3 | BU-PC.3 28.35,32.5 26,32.5 25.5,32 25.5,29.5 25,29 22.75,29 BU-D.3 | 34.65,32.5 37,32.5 37.5,33 37.5,35 38,35.5 41.5,35.5 42,36 42,37.5 41.5,38 25.5,38 25,38.5 25,45.13 25.11,45.3 v25.23,45.63 | 34.65,32.5 BU-PC.4 | U1.40 30.7,59.87 v30.62,59.92 | 30.67,61.76 U1.40 | RN2.8 30.8,65.8 30.5,65.5 30.5,63.25 30.75,63 30.75,61.77 U1.40
  Bottom 0.203: v30.62,59.92 30.26,59.56 30.26,58.6 29.65,57.99 29.65,57.38 29.45,57.18 29.45,52.7 25.5,48.75 25.5,45.89 v25.23,45.63
PA1  (via drill 0.3)  (3 unrouted)
  Top 0.203: 4.35,29 6,29 6.5,28.5 6.5,12.5 7,12 14,12 14.5,12.5 14.5,13.5 15,14 16.25,14 BU-5.4 | 4.35,29 BU-C.4 | 4.35,29 2.5,29 2,29.5 2,43.5 2.5,44 4.35,44 BU-GO.4 | BU-C.3 10.65,29 12.5,29 13,29.5 13,33.5 13.5,34 19,34 19.5,34.5 19.5,38 20,38.5 24,38.5 24.5,39 24.5,44.75 23.5,45.63 v23,45.63 | v29.88,60.3 29.9,60.52 U1.41 29.87,61.75 29.87,67 RN2.7
  Bottom 0.203: v23,45.63 22.97,46.92 29.04,53.15 29.04,57.38 29.25,57.58 29.25,58.19 29.85,58.8 29.85,60.28 v29.88,60.3
PA2  (via drill 0.3)  (3 unrouted)
  Top 0.203: 18.5,19 18.5,16.5 18,16 13.5,16 13,15.5 13,14.5 12.5,14 10.75,14 BU-4.3 | BU-B.4 46.65,17.5 45.5,17.5 45,18 45,32 45.6,32.6 BU-PLUS.4 | 18.5,19 24,19 24.5,18.5 24.5,16 25,15.5 31.5,15.5 32,16 32,19.5 32.5,20 40,20 40.5,19.5 40.5,17.75 BU-B.3 | v22,45.63 22.5,45 23.5,45 24,44.5 24,39.5 23.5,39 19.5,39 19,38.5 19,35 18.5,34.5 13,34.5 12.5,34 12.5,30.5 12,30 9.5,30 9,29.5 9,28.5 9.5,28 13,28 13.5,28.5 13.5,33 14,33.5 18,33.5 18.5,33 18.5,19 | v29,60.42 29.1,60.52 29.1,61.16 | 29.1,61.16 U1.42 29.06,61.77 29.06,66.98 RN2.6 | 29.04,61.22 29.1,61.16
  Bottom 0.203: v22,45.63 21.97,46.98 28.64,53.6 28.64,57.58 28.84,57.79 28.84,58.4 29.45,59.01 29.45,59.54 29.04,59.95 29.04,60.38 v29,60.42
PA3  (via drill 0.3)  (3 unrouted)
  Top 0.203: BU-A.4 34.65,17.5 37,17.5 37.5,17 37.5,7 38.1,6.4 BU-3.4 | BU-DA.4 22.65,32.5 21,32.5 20.5,32 20.5,20.5 21,20 25,20 25.5,19.5 25.5,18 26,17.5 28.25,17.5 BU-A.3 | v21,45.63 21,41.5 20.5,41 19,41 18.5,40.5 18.5,35.5 18,35 12.5,35 12,34.5 12,31 11.5,30.5 9,30.5 8.5,30 8.5,28 9,27.5 13.5,27.5 14,28 14,32 14.5,32.5 16.35,32.5 BU-DA.3 | v28.75,59.25 28.75,59.22 28.23,59.74 28.23,61.65 U1.43 28.25,61.78 28.25,66.99 RN2.5
  Bottom 0.203: v21,45.63 21,47.07 28.23,54.05 28.23,57.79 28.43,57.99 28.43,59.07 v28.75,59.25
PA4  (via drill 0.3)  (3 unrouted)
  Top 0.203: 8,32.5 8,20 8.5,19.5 13.5,19.5 14,19 14,18 14.5,17.5 16.25,17.5 BU-9.3 | 8,32.5 4.35,32.5 BU-AD.3 | v20,45.63 20,42 19.5,41.5 8.5,41.5 8,41 8,32.5 | RN1.8 26.3,63.13 26.5,62.92 U1.44 v27.5,60.42 | BU-9.4 22.55,17.5 21,17.5 20.5,17 20.5,8.5 21,8 28,8 28.5,7.5 28.5,6.55 BU-2.4
  Bottom 0.203: v20,45.63 20,46.93 27.82,54.26 27.82,57.99 28.03,58.19 28.03,59.74 27.62,60.15 27.62,60.3 v27.5,60.42
PA5  (via drill 0.3)  (3 unrouted)
  Top 0.203: 6,5 6,17 5.5,17.5 4.45,17.5 BU-8.3 | 6,5 6,4.5 6.5,4.5 | 6.5,4.5 16,4.5 16.5,5 16.5,6.25 BU-1.4 | BU-F.3 40.35,25 42.5,25 43,24.5 43,5.5 42.5,5 25,5 24.5,5.5 24.5,6 24,6.5 22.75,6.5 BU-1.3 | v19,45.63 19,42.5 18.5,42 8,42 7.5,41.5 7.5,34.5 7,34 3.5,34 3,33.5 3,31.5 3.5,31 7,31 7.5,30.5 7.5,18 8,17.5 10.65,17.5 BU-8.4 | v27,59.67 26.75,59.92 U1.1 25.4,60.22 RN1.7 | 6,5 6.5,4.5
  Bottom 0.203: v19,45.63 19,46.79 27.42,54.46 27.42,58.19 27.62,58.4 27.62,59.05 v27,59.67
PA6  (via drill 0.3)  (3 unrouted)
  Top 0.203: BU-0.3 10.5,6.4 10.5,7 11,7.5 19.5,7.5 | 19.5,7.5 19.5,4.5 20,4 43.5,4 44,4.5 44,10.1 | 40.35,10 BU-7.3 | BU-7.4 44,10.1 | 44,10.1 44,26 43.5,26.5 38,26.5 37.5,26 37.5,25.5 37,25 34.75,25 BU-E.4 | v18,45.63 18,43 17.5,42.5 7.5,42.5 7,42 7,35 6.5,34.5 3,34.5 2.5,34 2.5,31 3,30.5 6.5,30.5 7,30 7,13 7.5,12.5 13.5,12.5 14,13 14,14.5 14.5,15 19,15 19.5,14.5 19.5,7.5 | v27,58.8 26.83,58.92 26.5,59 25.82,59 U1.2 24.88,59.12 24.5,59.5 24.5,66.93 RN1.6
  Bottom 0.203: v27,58.8 27.01,57.24 27.01,54.66 18,46.65 v18,45.63
PA7
  Top 0.203: U1.3 24.68,58.32 24,59 24,66 23.75,66.25 23.75,66.98 RN1.5
PDI_CLOCK  (via drill 0.3, 0.4)
  Top 0.203: RN4.1 46.55,64.3 46.25,64 v43.25,64 43.25,61.5 43,61.25 43,53.75 49.25,47.5 49.25,43.25 v48.5,42.5 | v40.25,64 40.25,66 39.25,67 34.75,67 34,66.25 34,63.25 34.7,62.55 U1.35
  Bottom 0.203: v43.25,64 v40.25,64 | v48.5,42.5 51.62,42.5 PDI-CLK.P$2
PDI_DATA  (via drill 0.3, 0.4)
  Top 0.203: 40.22,61.72 v40.25,61.75 40,62 36.5,62 36.22,61.72 U1.34 | RN4.4 43.93,65 42.75,65 42.5,64.75 42.5,61.88 v42.62,61.75 42.5,61.63 42.5,53.5 48.5,47.5 v48.5,45.25
  Bottom 0.203: v40.25,61.75 v42.62,61.75 | v48.5,45.25 51.41,45.25 PDI-DATA.P$2
PE0  (via drill 0.8)
  Top 0.203: v39.88,54.5 39.25,54.5 38.75,55 38.75,55.75 38.5,56 37.38,56 U1.28
PE1  (via drill 0.8)
  Top 0.203: v39.88,56 39.25,56 38.5,56.75 37.33,56.75 U1.29
PE2  (via drill 0.8)
  Top 0.203: U1.32 38.37,59.12 38.75,59.5 v38.75,61
PE3  (via drill 0.8)
  Top 0.203: U1.33 37.3,60.95 v37.25,61
Q1C
  Top 0.203: Q1.3 7.9,70.1 7.5,70.5 6,70.5 5.5,71 DI1.P$3 DI1.P$8
Q2C
  Top 0.203: Q2.3 13.5,69.4 13.5,70 13,70.5 DI2.P$3 DI2.P$8
Q3C
  Top 0.203: Q3.3 19.5,69.1 19.5,70 20.5,71 DI3.P$3 DI3.P$8
Q4C  (via drill 0.3)
  Top 0.203: Q4.3 32.9,69.6 32.5,70 32.5,73.5 v33,74 | DI4.P$8 v28,74 DI4.P$3
  Bottom 0.203: v33,74 31.25,74 30.5,74.75 28.5,74.75 v28,74
Q5C
  Top 0.203: DI5.P$8 DI5.P$3 36.5,71.25 37.9,69.85 Q5.3
Q6C
  Top 0.203: Q6.3 43,69.1 43,70 44,71 DI6.P$3 DI6.P$8
RSET  (via drill 0.3)  (1 unrouted)
  Top 0.203: 27.63,43.9 BU-RESET.1 28.25,44.01 28.25,44.5 26.5,46.5 v16.38,46.5 | v24.57,55.88 25.66,55.88 U1.6
  Bottom 0.203: v16.38,46.5 16.88,47 25.18,54.26 25.18,55.68 24.98,55.88 v24.57,55.88
SCL  (via drill 0.3)
  Top 0.203: U1.11 31.67,51.92 v34.75,55 | U4.6 50.12,71.87 48.5,70.25 48.5,66 | RN4.2 45.65,65.9 45.75,66 48.5,66 | 48.5,66 48.5,59.25 44.5,55 v43.75,55
  Bottom 0.203: v34.75,55 36.5,55 38.5,53 41,53 43,55 v43.75,55
SDA  (via drill 0.3)
  Top 0.203: U4.5 48.84,71.35 47.75,70.25 v47.75,66.75 45.25,66.75 44.85,66.35 RN4.3 | U1.10 31.47,52.72 v34.75,56 | v47.75,65.25 47.75,59.25 v44.38,55.88
  Bottom 0.203: v47.75,65.25 v47.75,66.75 | v34.75,56 36.25,56 38.75,53.5 40.75,53.5 43,55.75 43.75,55.75 v44.38,55.88
SST  (via drill 0.3)
  Top 0.203: U1.7 24.13,55.12 23.75,55.5 22.25,55.5 22,55.25 22,52 22.75,51.25 32,51.25 v34.75,54 | U$2.NC 49,50.75 v45.25,54
  Bottom 0.203: v34.75,54 36.75,54 38.25,52.5 41.25,52.5 42.75,54 v45.25,54
STEP  (via drill 0.3)  (1 unrouted)
  Top 0.203: BU-STEP.1 16.35,45 v17.07,45.6 | v24.57,56.69 25.67,56.69 U1.5
  Bottom 0.203: v17.07,45.6 17.07,46.53 25.59,54.05 25.59,56.29 25.18,56.69 v24.57,56.69
VCC  (via drill 0.3, 0.4)
  Top 0.203: U4.8 52.66,74.1 53,73.75 53,73.1 C4.2 52.9,71.65 50.25,69 v49.75,69 49,68.25 49,58.75 44.5,54.25 44.5,53 48.5,49 v49,49 | LED-TX.A LED-RX.A 12.95,61.7 14.5,63.25 | LED-CPU.A LED-PWR.A 17.45,61.7 17.5,61.75 | RN4.5 43.95,62.05 44,62 | 44,62 44.75,62 | 44.75,62 45.75,62 | 45.75,62 46.5,62 46.5,62.98 RN4.8 | RN4.6 44.85,62.1 44.75,62 | RN4.7 45.65,62.1 45.75,62 | C7.2 v40,60 | v44,60 44,62
  Top 0.406: C7.2 39.85,58.92 39.25,58.92 38.9,58.32 U1.31 36.32,58.32 36,58 | C5.2 33.65,48.52 33.1,49.07 U1.19 33.1,51.35 33.25,51.5 35.75,51.5 36,51.75 36,53.5 | C2.2 23.85,52.77 24.6,53.52 U1.9 26.77,53.52 27,53.75 27,57.75 27.75,58.5 30.25,58.5 31.5,59.75 31.5,60.5 | 36,53.5 36,58 | 35.98,53.52 36,53.5 | Q1.2 11.45,69.95 v11.5,70 | v17.5,70 16.15,70 Q2.2 | v23,70 21.65,70 Q3.2 | Q4.2 36.45,69.95 v36.5,70 | Q5.2 41.45,69.95 v41.5,70 | Q6.2 46.45,69.95 v46.5,70 | 52.75,72.85 C4.2 | 31.26,65.26 v31.75,65.75 | C6.2 31.26,63.5 31.5,63.25 U1.39 31.5,60.5 | 36,58 36,60.25 35.75,60.5 31.5,60.5
  Top 0.61: U$1.COM 3.75,65.25 4.25,65.75 5.25,65.75 5.75,66.25 v11.5,66.25 14.5,63.25 16,61.75 17.5,61.75 18.75,61.75 v21.5,64.5 | C6.2 31.26,65.26
  Bottom 0.203: v40,60 v44,60 | v49,49 51.1,47.4 PDI-VCC.P$2
  Bottom 0.406: v11.5,70 v17.5,70 v23,70 24.5,68.5 30.25,68.5 31.5,70 v36.5,70 v41.5,70 v46.5,70
  Bottom 0.61: v11.5,66.25 v11.5,70 | v31.75,65.75 22.75,65.75 v21.5,64.5 | v46.5,70 arc90 47.5,69 v49.75,69
VUSB
  Top 0.203: U3.3 8.45,60.3 9,59.75 9,56.75
  Top 0.406: C1.2 12.5,46.5 13,47 | 13,47 13.5,47.5 13.5,48.09 U2.1 | USB1.P1 5.8,52.3 6.5,53 6.5,56.75 | 6.5,56.75 6.5,58 6.1,58.4 C9.2 6.1,59.85 6.5,60.25 6.5,60.9 U3.1 | 13,47 11,49 11,55.25 9.5,56.75 9,56.75 6.5,56.75 | U3.3 8.5,60.9

### Text on the board
tPlace: BAT | E3 | RX | E2 | USB | PWR | TX | CPU | E1 | E0 | SST | Go | St | Rs | Ad | Da | Pc | + | C | D | E | F | 8 | 9 | A | B | 4 | 5 | 6 | 7 | 0 | 1 | 2 | 3
bPlace: KimCard - r5 - SmallRoomLabs.com | PDI | VCC | DAT | CLK | GND
tStop: KimCard - r5 - SmallRoomLabs.com
bStop: 30mil/8% | 30mil/10% | 30mil/12% | 40mil/10% | 40mil/12% | 30mil/14% | 35mil/8% | 35mil/10% | 40mil/14% | 45mil/8% | 35mil/12% | 35mil/14% | 40mil/8% | 45mil/10% | 45mil/14% | 45mil/12% | (Ind),Y | (Ind,X) | Abs,Y | Abs,X | Abs | Zp,Y | Zp,X | Zp | Imm | Acc | BRK:00 NOP:EA / CLC:18 SEC:38 / CLD:D8 SED:F8 / CLI:58 SEI:78 / DEY:88 DEX:CA / INY:C8 INX:E8 / TXA:8A TYA:98 / TAX:AA TAY:A8 / TXS:9A TSX:BA / PHP:08 PLP:28 / PHA:48 PLA:68 / BPL:10 BMI:30 / BVS:70 BVC:50 / BCS:B0 BCC:90 / BEQ:F0 BNE:D0 / JSR:20 RTS:60 / JMP:4C JMPi:6C / RTI:40 CLV:B8 | N-Z- LDA -- A9 A5 B5 -- AD BD B9 A1 B1 / N-Z- LDX -- A2 A6 -- B6 AE -- BE -- -- / N-Z- LDY -- A0 A4 B4 -- AC BC -- -- -- / ---- STA -- -- 85 95 -- 8D 9D 99 81 91 / ---- STX -- -- 86 -- 96 8E -- -- -- -- / ---- STY -- -- 84 94 -- 8C -- -- -- -- / N-ZC AND -- 29 25 35 -- 2D 3D 39 21 31 / N-Z- ORA -- 09 05 15 -- 0D 1D 19 01 11 / N-Z- EOR -- 49 45 55 -- 4D 5D 59 41 51 / NVZC ADC -- 69 65 75 -- 6D 7D 79 61 71 / NVZC SBC -- E9 E5 F5 -- ED FD F9 E1 F1 / N-Z- INC -- -- E6 F6 -- EE FE -- -- -- / N-Z- DEC -- -- C6 D6 -- CE DE -- -- -- / N-ZC ASL 0A -- 06 16 -- 0E 1E -- -- -- / N-ZC LSR -- 4A 46 56 -- 4E 5E -- -- -- / N-ZC ROL 2A -- 26 36 -- 2E 3E -- -- -- / N-ZC ROR 6A -- 66 76 -- 6E 7E -- -- -- / N-ZC CMP -- C9 C5 D5 -- CD DD D9 C1 D1 / N-ZC CPX -- E0 E4 -- -- EC -- -- -- -- / N-ZC CPY -- C0 C4 -- -- CC -- -- -- -- / NVZ- BIT -- -- 24 -- -- 2C -- -- -- --
200bmp: /Users/matseng/Documents/eagle/projects/KimCard/doc/CheatSheet.bmp